# Altium schematic sheet Printing.SchDoc (part 2 of 2)
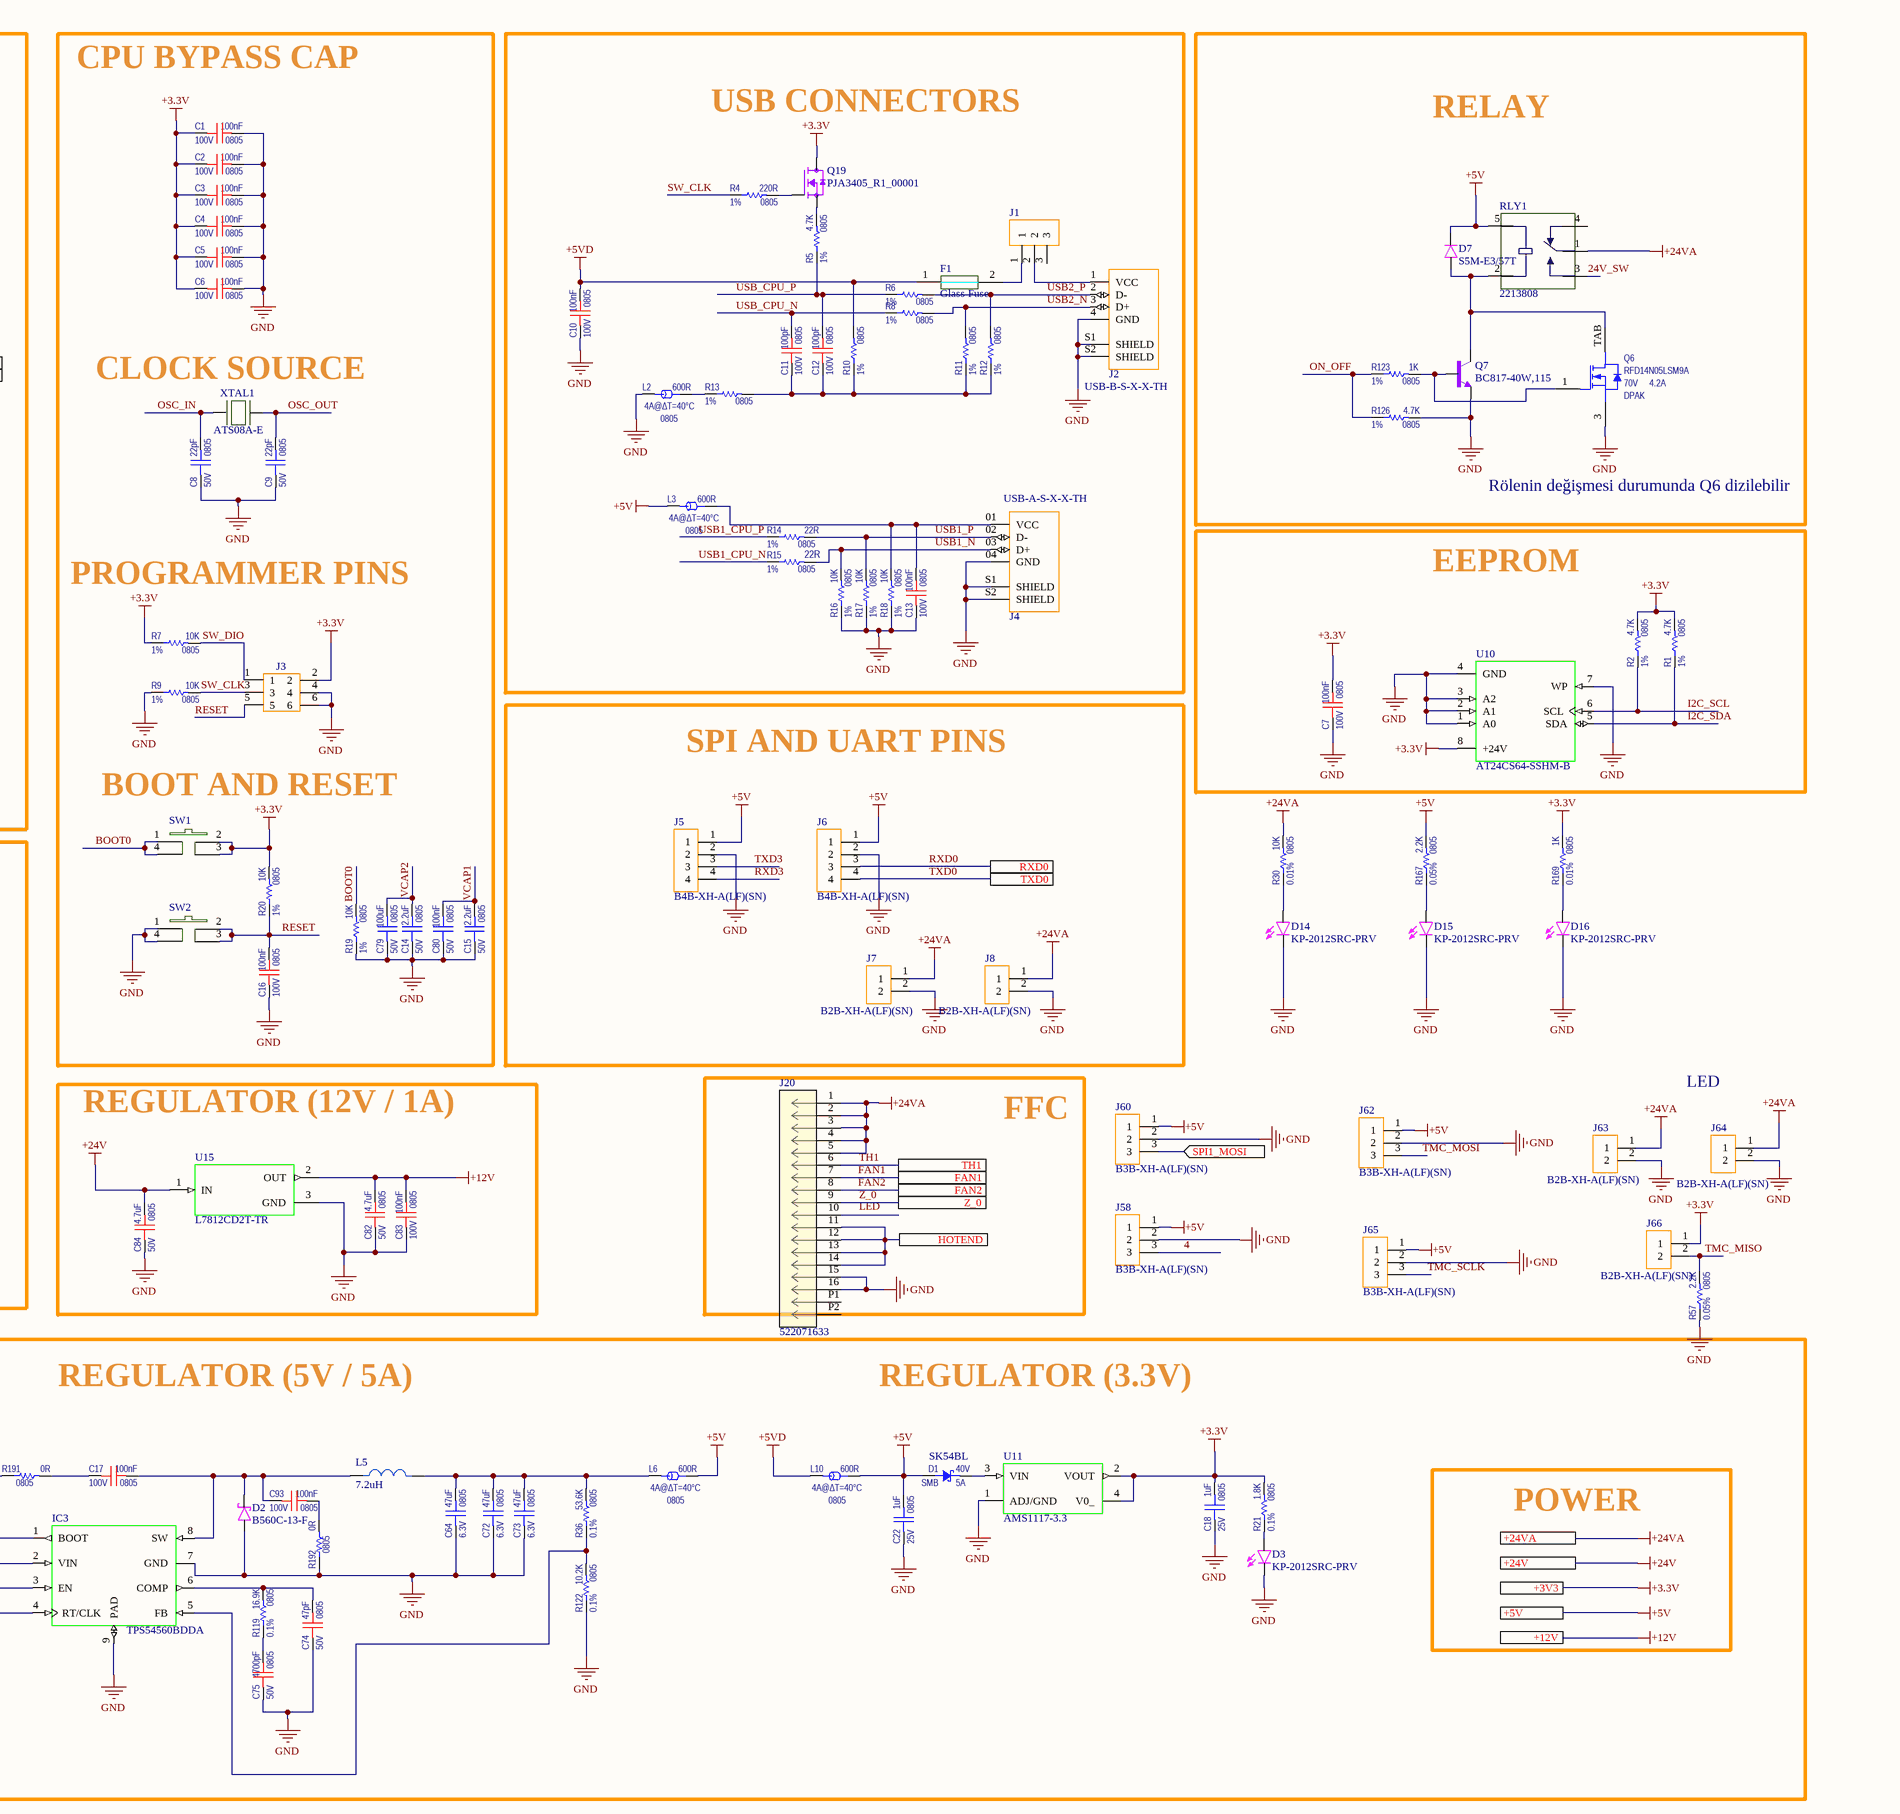
[diagram p2: Printing.SchDoc, right]

## Library data of the parts
C1-C7 C10-C13 C16 C17 C19 C27 C37 C70 C71 C74 C75 C77 C82-C85 C93 = CER_100nF_#4: CAP_CER_100nF_100V_X7R_10%_0805; Manufacturer#1: Kemet; Manufacturer#1 PN: C0805C104K1RECAUTO; Manufacturer#2 PN: ESD51C104K4T2A-24; Similar Part: C0805C104J1RECAUTO7210; C0805X104J1RECAUTO; Added by: İlhanT; FireANTs Code: C00062; Grade Level: Automotive; Lead Status: Pb-Free; Location: 3B16; Max Reflow Duration: 30; Max Reflow Temp: 260; Placement Area: 10.45; Power Rating: X; Temp# Operating: -55°C/+125°C; Tolerance: 10%; Identifier: CER_100nF_#4; Checked by: İlkerU; ComponentLink1Description: Resource Folder; ComponentLink1URL: C:\FireANTs_Repo\HW_Lib\trunk\ComponentLibrary\Resources\Capacitors\C00062; Cost: 0.27; Current: N/A; Failure in Time: N/A; Features: AEC-Q200; ESD withstanding; Height: 1.40; Manufacturer#2: AVX; MSL: 1; Mounting Type: SMD; Part Status: Active; Temp# Storage: N/A; Weight: 19mg
C8 C9 = CER_22pF_#2: CAP_CER_22pF_50V_X5R_5%_0805; Manufacturer#1: Kemet; Manufacturer#1 PN: C0805C220J5GAC7800; Added by: HicabiB; FireANTs Code: C00169; Grade Level: Automotive; Lead Status: Pb-Free; Location: 3E18; Max Reflow Duration: 30; Max Reflow Temp: 260; Placement Area: 10.45; Power Rating: X; Temp# Operating: -55°C/+125°C; Tolerance: 5%; Identifier: CER_22pF_#2; Checked by: ???; ComponentLink1Description: Resource Folder; ComponentLink1URL: C:\FireANTs_Repo\HW_Lib\trunk\ComponentLibrary\Resources\Capacitors\C00169; Cost: 0.10; Current: N/A; Failure in Time: N/A; Features: N/A; Height: 0.88; Manufacturer#2: N/A; Manufacturer#2 PN: N/A; MSL: 1; Mounting Type: SMD; Part Status: Active; Similar Part: N/A; Temp# Storage: N/A; Weight: N/A
C14 C15 C79 C80 = CER_2.2uF_#9: CAP_CER_2.2uF_50V_X5R_10%_0805; Manufacturer#1: Samsung; Manufacturer#1 PN: CL21A225KBFNNNE; Added by: HicabiB; FireANTs Code: C00170; Grade Level: Automotive; Lead Status: Pb-Free; Location: 3F18; Max Reflow Duration: 30; Max Reflow Temp: 260; Placement Area: 10.45; Power Rating: X; Temp# Operating: -55°C/+85°C; Tolerance: 10%; Identifier: CER_2.2uF_#9; Checked by: ???; ComponentLink1Description: Resource Folder; ComponentLink1URL: C:\FireANTs_Repo\HW_Lib\trunk\ComponentLibrary\Resources\Capacitors\C00170; Cost: 0.22; Current: N/A; Failure in Time: N/A; Features: N/A; Height: 1.35; Manufacturer#2: N/A; Manufacturer#2 PN: N/A; MSL: 1; Mounting Type: SMD; Part Status: Active; Similar Part: N/A; Temp# Storage: N/A; Weight: 16.4mg
C18 C22 = CER_1uF_#1: CAP_CER_1uF_25V_X7R_10%_0805; Manufacturer#1: Kemet; Manufacturer#1 PN: C0805C105K3RACAUTO; Manufacturer#2 PN: GCM21BR71E105KA56L; Similar Part: CGA4J3X7R1E105K125AB; Added by: SonerI; FireANTs Code: C00010; Grade Level: Automotive; Lead Status: Pb-Free; Location: 3B3; Max Reflow Duration: 30; Max Reflow Temp: 260; Placement Area: 10.45; Power Rating: X; Temp# Operating: -55°C/+125°C; Tolerance: 10%; Identifier: CER_1uF_#1; Checked by: İlkerU; ComponentLink1Description: Resource Folder; ComponentLink1URL: C:\FireANTs_Repo\HW_Lib\trunk\ComponentLibrary\Resources\Capacitors\C00010; Cost: 0.19; Current: N/A; Failure in Time: N/A; Features: AEC-Q200; Height: 1.40; Manufacturer#2: Murata; MSL: 1; Mounting Type: SMD; Part Status: Active; Temp# Storage: N/A; Weight: 19mg
C20 C21 = SC1V107M6L07KVR
C64 C72 C73 = CER_47uF_#2: CAP_CER_47uF_6.3V_X5R_20%_0805; Manufacturer#1: Murata; Manufacturer#1 PN: GRM21BR60J476ME15L; Manufacturer#2 PN: C0805C476M9PACTU; Similar Part: JMK212BBJ476MG-T; Added by: HasanA; FireANTs Code: C00140; Grade Level: Industrial; Lead Status: Pb-Free; Location: 3H10; Max Reflow Duration: 30; Max Reflow Temp: 260; Placement Area: 10.45; Power Rating: X; Temp# Operating: -55°C/+85°C; Tolerance: 20%; Identifier: CER_47uF_#2; Checked by: İlkerU; ComponentLink1Description: Resource Folder; ComponentLink1URL: C:\FireANTs_Repo\HW_Lib\trunk\ComponentLibrary\Resources\Capacitors\C00140; Cost: 0.48; Current: N/A; Failure in Time: N/A; Features: N/A; Height: 1.40; Manufacturer#2: Kemet; MSL: 1; Mounting Type: SMD; Part Status: Not For New Designs; Temp# Storage: N/A; Weight: 19mg
C94 = CER_1nF_#8: CAP_CER_1nF_50V_NP0_1%_0805; Manufacturer#1: Yageo; Manufacturer#1 PN: CC0805FRNPO9BN102; Manufacturer#2 PN: VJ0805A102FXACW1BC; Similar Part: 08055A102FAT2A; Added by: İlhanT; FireANTs Code: C00021; Grade Level: Industrial; Lead Status: Pb-Free; Location: 3A6; Max Reflow Duration: 30; Max Reflow Temp: 260; Placement Area: 10.45; Power Rating: X; Temp# Operating: -55°C/+125°C; Tolerance: 1%; Identifier: CER_1nF_#8; Checked by: İlkerU; ComponentLink1Description: Resource Folder; ComponentLink1URL: C:\FireANTs_Repo\HW_Lib\trunk\ComponentLibrary\Resources\Capacitors\C00021; Cost: 0.27; Current: N/A; Failure in Time: N/A; Features: N/A; Height: 0.70; Manufacturer#2: Vishay; MSL: 1; Mounting Type: SMD; Part Status: Active; Temp# Storage: N/A; Weight: 9.6mg
D1 D8 D17 = SCHO_60V_3A_#1: DIO_SCHO_SING_60V_3A_SMB; Manufacturer#1: Onsemi; Manufacturer#2 PN: MBRS360BT3G; Similar Part: STPS3H100UFY; Value: NRVBS360BT3G; Added by: SonerI; FireANTs Code: D00042; Failure in Time: 0.16@[60%CL; 55°C; 0.7eV]; Grade Level: Automotive; Lead Status: Pb-Free; Location: 4F11; Max Reflow Duration: 10; Max Reflow Temp: 260; Placement Area: 36.00; Temp# Operating: -65°C/+175°C; Tolerance: X; Identifier: SCHO_60V_3A_#1; Checked by: ErayC; ComponentLink1Description: Resource Folder; ComponentLink1URL: C:\FireANTs_Repo\HW_Lib\trunk\ComponentLibrary\Resources\Diodes\D00042; Cost: 0.84; Features: AEC-Q101; Fast recovery; Schottky Power Rectifier; Height: 2.47; Manufacturer#1 PN: NRVBS360BT3G; Manufacturer#2: Onsemi; MSL: 1; Mounting Type: SMD; Part Status: Active; Power Rating: N/A; Temp# Storage: -65°C/+175°C; Weight: 101.45mg
D2 = B560C-13-F: VR=60V IF=5A 300pF; Manufacturer: Diodes; Forward Current: 5A; Max Reverse Current: 500uA; Max Repetitive Reverse Voltage (Vrrm): 60V; Element Configuration: Single; Polarity: Standard; Forward Voltage: 700mV; Max Forward Surge Current (Ifsm): 100A; Supplier 1: Farnell; Manufacturer Part Number: B560C-13-F; RoHS: Yes; Category: Rectifier Diodes; Stock 1: 3160; Pricing 1: 5=0,58300, 10=0,49900, 100=0,37300, 500=0,29400 (EUR); Mount: Surface Mount; Case/Package: SMC; Number of Pins: 2; Weight: 0.007408oz; Contact Plating: Tin,Matte; Min Operating Temperature: -55°C; Max Operating Temperature: 125°C; Package Quantity: 3000; Packaging: Tape and Reel; Output Current: 5A; Series: -; Average Rectified Current: 5A; Peak Non-Repetitive Surge Current: 100A; Termination: SMD/SMT; Voltage Rating (DC): 60V; Current Rating: 5A; Capacitance: 300pF; Max Reverse Voltage (DC): 60V; Length: 7.11mm; Width: 6.22mm; Height: 2.5mm; Radiation Hardening: No; Lead Free: Lead Free; RoHS Compliant: Yes; Reach SVHC Compliant: Yes; ComponentLink1URL: https://datasheet.ciiva.com/27052/1538961-27052355.pdf?src-supplier=Jameco; ComponentLink1Description: https://datasheet.ciiva.com/27052/1538961-27052355.pdf?src-supplier=Jameco; ComponentLink2URL: https://datasheet.ciiva.com/1177/ds13012-1177532.pdf?src-supplier=Element14; ComponentLink2Description: https://datasheet.ciiva.com/1177/ds13012-1177532.pdf?src-supplier=Element14; ComponentLink3URL: https://datasheet.ciiva.com/16389/ds13012-16389735.pdf?src-supplier=Future+Electronics; ComponentLink3Description: https://datasheet.ciiva.com/16389/ds13012-16389735.pdf?src-supplier=Future+Electronics; ComponentLink4URL: https://datasheet.ciiva.com/15144/getdatasheetpartid-89786-15144652.pdf?src-supplier=Verical; ComponentLink4Description: https://datasheet.ciiva.com/15144/getdatasheetpartid-89786-15144652.pdf?src-supplier=Verical; ComponentLink5URL: https://datasheet.ciiva.com/914/ds13012-914986.pdf?src-supplier=Digi-Key; ComponentLink5Description: https://datasheet.ciiva.com/914/ds13012-914986.pdf?src-supplier=Digi-Key; ComponentLink6URL: https://datasheet.ciiva.com/914/ds13012-914987.pdf?src-supplier=Digi-Key; ComponentLink6Description: https://datasheet.ciiva.com/914/ds13012-914987.pdf?src-supplier=Digi-Key; ComponentLink7URL: https://datasheet.ciiva.com/914/ds13012-914985.pdf?src-supplier=Digi-Key; ComponentLink7Description: https://datasheet.ciiva.com/914/ds13012-914985.pdf?src-supplier=Digi-Key; Supplier Part Number 1: 1858602
D3 D6 D14-D16 = KP-2012SRC-PRV: KP-2012SRC-PRV Red LED, 640 nm 2012 (0805), Rectangle Lens SMD package; Manufacturer: Kingbright; Lens Color: Clear; Viewing Angle: 120°; Lens Style: Rectangular,Diffused,Colorless; Number of LEDs: 1; Wavelength: 640nm; Luminous Intensity: 100mcd; Forward Voltage: 1.85V; Forward Current: 20mA; Supplier 1: Farnell; Manufacturer Part Number: KP-2012SRC-PRV; RoHS: Yes; Category: LEDs; Pricing 1: 5=0,12900, 50=0,10200, 100=0,09830, 500=0,08370, 1000=0,07290 (EUR); Mount: Surface Mount; Case/Package: 2012; Number of Pins: 2; Color: Red; Min Operating Temperature: -40°C; Max Operating Temperature: 85°C; Packaging: Cut Tape; Dominant Wavelength: 640nm; Radiation Hardening: No; Reach SVHC Compliant: Yes; RoHS Compliant: Yes; ComponentLink1URL: https://datasheet.ciiva.com/14176/kp2012src-prv-eng-tds-14176962.pdf?src-supplier=Distrelec; ComponentLink1Description: https://datasheet.ciiva.com/14176/kp2012src-prv-eng-tds-14176962.pdf?src-supplier=Distrelec; ComponentLink2URL: https://datasheet.ciiva.com/11773/0900766b8032fa8d-11773524.pdf?src-supplier=RSComponents; ComponentLink2Description: https://datasheet.ciiva.com/11773/0900766b8032fa8d-11773524.pdf?src-supplier=RSComponents; ComponentLink3URL: https://datasheet.ciiva.com/14634/0900766b8032fa8d-14634746.pdf?src-supplier=Allied+Electronics; ComponentLink3Description: https://datasheet.ciiva.com/14634/0900766b8032fa8d-14634746.pdf?src-supplier=Allied+Electronics; ComponentLink4URL: https://datasheet.ciiva.com/29281/180105-da-01-en-led-0805-typ-kp-2012src-prv-29281248.pdf?src-supplier=Conrad; ComponentLink4Description: https://datasheet.ciiva.com/29281/180105-da-01-en-led-0805-typ-kp-2012src-prv-29281248.pdf?src-supplier=Conrad; Supplier Part Number 1: 1318244
D7 = S5M-E3/57T: STANDARD DIODE, 5A, 1KV, DO-214AB, FULL REEL; Diode Configuration:Single; Repetitive Reverse Voltage Vrrm Max:1kV; Forward Current If(AV):5A; Forward Voltage VF Max:1.15V; Forward Surge Current Ifsm Max:100A; No. of Pins:2 Pin ;RoHS Compliant: Yes; Manufacturer: Vishay Semiconductors; Max Surge Current: 100A; Forward Voltage: 1.15V; Max Reverse Current: 10uA; Reverse Recovery Time: 2.5us; Element Configuration: Single; Recovery Time: 2500ns; Capacitance: 40pF; Supplier 1: Farnell; Manufacturer Part Number: S5M-E3/57T; RoHS: Yes; Category: Rectifier Diodes; Stock 1: 21261; Pricing 1: 5=0,46000, 10=0,38000, 100=0,29400, 500=0,17900, 1000=0,15400, 5000=0,14900 (EUR); Mount: Surface Mount; Case/Package: SMC; Number of Pins: 2; Contact Plating: Tin,Matte; Min Operating Temperature: -55°C; Max Operating Temperature: 150°C; Package Quantity: 850; Packaging: Tape and Reel; Forward Current: 5A; Average Rectified Current: 5A; Max Repetitive Reverse Voltage (Vrrm): 1kV; Peak Non-Repetitive Surge Current: 100A; Max Forward Surge Current (Ifsm): 100A; Max Reverse Voltage (DC): 1kV; Series: -; Polarity: Standard; Voltage Rating (DC): 1kV; Current Rating: 5A; Output Current: 5A; Current: 5A; Voltage: 1kV; Reverse Voltage: 1kV; Length: 7.11mm; Width: 6.22mm; Height: 2.42mm; Radiation Hardening: No; RoHS Compliant: Yes; Lead Free: Lead Free; ComponentLink1URL: https://datasheet.ciiva.com/26295/1912895-26295382.pdf?src-supplier=Element14; ComponentLink1Description: https://datasheet.ciiva.com/26295/1912895-26295382.pdf?src-supplier=Element14; ComponentLink2URL: https://datasheet.ciiva.com/46435/1794161-46435942.pdf?src-supplier=Element14; ComponentLink2Description: https://datasheet.ciiva.com/46435/1794161-46435942.pdf?src-supplier=Element14; ComponentLink3URL: https://datasheet.ciiva.com/8287/s5a-8287111.pdf?src-supplier=Avnet; ComponentLink3Description: https://datasheet.ciiva.com/8287/s5a-8287111.pdf?src-supplier=Avnet; Supplier Part Number 1: 2395851
Fuse1 = 696310001002: Fuse Holder 20 A 250V 1 Circuit Cartridge Through Hole; MF: Wurth Elektronik; Package: None; Price: None; Value: *; SnapEDA_Link: https://www.snapeda.com/parts/696310001002/Wurth+Elektronik/view-part/?ref=snap; MP: 696310001002; Availability: In Stock; Check_prices: https://www.snapeda.com/parts/696310001002/Wurth+Elektronik/view-part/?ref=eda
IC2 = MCU-STM32F407VET6(LQFP100): ARMÂ® CortexÂ®-M4 STM32F4 Microcontroller IC 32-Bit 168MHz 512KB _512K x 8_ FLASH 100-LQFP _14x14_; MF: STMicroelectronics; SnapEDA_Link: https://www.snapeda.com/parts/STM32F407VET6/STMicroelectronics/view-part/45214/?ref=snap; MP: STM32F407VET6; Price: None; Package: LQFP-100 STMicroelectronics; Value: *; Availability: Unavailable
IC3 = TPS54560BDDA: 4.5-V to 60-V input, 5-A, step-down DC-DC converter with Eco-mode 8-SO PowerPAD -40 to 150; MF: Texas Instruments; Arrow_Electronics-Purchase-URL: https://snapeda.com/shop?store=Arrow+Electronics&id=4328218; Price: None; SnapEDA_Link: https://www.snapeda.com/parts/TPS54560BDDA/Texas%20Instruments/view-part/4328218/?ref=snap; Mouser-Purchase-URL: https://snapeda.com/shop?store=Mouser&id=4328218; DigiKey-Purchase-URL: https://snapeda.com/shop?store=DigiKey&id=4328218; Value: *; Package: HSOIC-8 Texas Instruments; Availability: Good; Texas_Instruments-Purchase-URL: https://snapeda.com/shop?store=Texas+Instruments&id=4328218; MP: TPS54560BDDA
J2 = USB-B-S-X-X-TH: USB-B (USB TYPE-B) USB 2.0 Receptacle Connector 4 Position Through Hole, Right Angle; Package: None; Price: None; Availability: Unavailable; MP: USB-B-S-X-X-TH; Value: *; Supplier 1: Farnell; Supplier Part Number 1: 3664925
J4 = USB-A-S-X-X-TH: USB-A (USB TYPE-A) USB 2.0 Receptacle Connector 4 Position Through Hole, Right Angle; MP: USB-A-S-S-W-TH; MF: Samtec; Package: None; Value: *; SnapEDA_Link: https://www.snapeda.com/parts/USB-A-S-S-W-TH/Samtec%20Inc./view-part/423470/?ref=snap; Digi-Key_Part_Number: SAM10373-ND; Toby_UK-Purchase-URL: https://snapeda.com/shop?store=Toby+UK&id=423470
J7 J8 J63 J64 J66 = B2B-XH-A(LF)(SN): Connector Header Through Hole 2 position 0.098 (2.50mm); MF: JST Sales; MP: B2B-XH-A(LF)(SN); Package: None; SnapEDA_Link: https://www.snapeda.com/parts/B2B-XH-A(LF)(SN)/JST+Sales+America+Inc./view-part/?ref=snap; Purchase-URL: https://pricing.snapeda.com/search/part/B2B-XH-A(LF)(SN)/?ref=eda; Check_prices: https://www.snapeda.com/parts/B2B-XH-A(LF)(SN)/JST+Sales+America+Inc./view-part/?ref=eda; Availability: In Stock; Value: *; Price: None
J20 = 522071633: No Description Available; Mfr_Name: Molex Connector Corporation; RefDes: RefDes; Type: Type
J47 = BH10B-XH-2(LF)(SN): Connector Header, XH Series, 10 Position, 2.5mm, 250V, Through Hole, Press Fit, Solder, Natural; Manufacturer: JST; Supplier 1: Digi-Key; Manufacturer Part Number: BH10B-XH-2(LF)(SN); RoHS: No; Category: Connectors; Stock 1: 53; Pricing 1: 1=0,77000, 10=0,65200, 100=0,58540, 500=0,47898, 1000=0,42576, 5000=0,37254, 10000=0,35392 (USD); ComponentLink1URL: http://www.jst-mfg.com/product/pdf/eng/eXH-H.pdf?src-supplier=Digi-Key; ComponentLink1Description: http://www.jst-mfg.com/product/pdf/eng/eXH-H.pdf?src-supplier=Digi-Key; Supplier Part Number 1: 455-BH10B-XH-2(LF)(SN)-ND
L1-L4 L6 L10 = FER_600R@100M_#2: IND_FER_600R@100M_2A_25%_0805; Manufacturer#1: Vishay; Manufacturer#1 PN: ILHB0805ER601V; Added by: HasanA; FireANTs Code: L00036; Grade Level: Industrial; Lead Status: Pb-Free; Location: 1R9; Max Reflow Duration: 10; Max Reflow Temp: 260; Placement Area: 10.45; Power Rating: X; Temp# Operating: -55°C/+125°C; Tolerance: ±25%; Identifier: FER_600R@100M_#2; Checked by: ErayC; ComponentLink1Description: Resource Folder; ComponentLink1URL: C:\FireANTs_Repo\HW_Lib\trunk\ComponentLibrary\Resources\Inductors\L00036; Cost: 0.11; Failure in Time: N/A; Features: N/A; Height: 1.10; Manufacturer#2: N/A; Manufacturer#2 PN: N/A; MSL: 1; Mounting Type: SMD; Part Status: Active; Similar Part: N/A; Temp# Storage: -55°C/+125°C; Voltage: X; Weight: 16mg
L5 = 7447798720: Fixed Ind 7.2UH 7.9A 12.8 Mohm; Manufacturer: Wurth Electronics; Core Material: Metal,Composite,Ferrite; Saturation Current: 6A; Tolerance: 30%; Shielding: Shielded; Self Resonant Frequency: 31MHz; DC Resistance (DCR): 12.8mR; Test Frequency: 100kHz; Max DC Current: 6.5A; Supplier 1: Newark; Manufacturer Part Number: 7447798720; RoHS: Yes; Category: Fixed Inductors; Mount: Surface Mount; Case/Package: Nonstandard; Min Operating Temperature: -40°C; Max Operating Temperature: 150°C; Package Quantity: 1; Current Rating: 7.9A; Packaging: Tape and Reel; Inductance Tolerance: 30%; Resistor Type: Wirewound; Inductance: 7.2uH; Termination: SMD/SMT; RMS Current (Irms): 7.9A; Series: WE-PDF; Length: 0.402inch; Width: 10.2mm; Height: 6.4mm; Height - Seated (Max): 0.252inch; RoHS Compliant: Yes; ComponentLink1URL: https://datasheet.ciiva.com/7892/1736564-7892967.pdf?src-supplier=Element14; ComponentLink1Description: https://datasheet.ciiva.com/7892/1736564-7892967.pdf?src-supplier=Element14; ComponentLink2URL: https://datasheet.ciiva.com/6171/530544-6171082.pdf?src-supplier=Farnell; ComponentLink2Description: https://datasheet.ciiva.com/6171/530544-6171082.pdf?src-supplier=Farnell; ComponentLink3URL: https://datasheet.ciiva.com/4954/7447798720-38957-4954724.pdf?src-supplier=Mouser; ComponentLink3Description: https://datasheet.ciiva.com/4954/7447798720-38957-4954724.pdf?src-supplier=Mouser; ComponentLink4URL: https://datasheet.ciiva.com/1060/7447798720-1060960.pdf?src-supplier=Digi-Key; ComponentLink4Description: https://datasheet.ciiva.com/1060/7447798720-1060960.pdf?src-supplier=Digi-Key; ComponentLink5URL: https://datasheet.ciiva.com/1060/7447798720-1060961.pdf?src-supplier=Digi-Key; ComponentLink5Description: https://datasheet.ciiva.com/1060/7447798720-1060961.pdf?src-supplier=Digi-Key; ComponentLink6URL: https://datasheet.ciiva.com/1060/7447798720-1060962.pdf?src-supplier=Digi-Key; ComponentLink6Description: https://datasheet.ciiva.com/1060/7447798720-1060962.pdf?src-supplier=Digi-Key; Supplier Part Number 1: 78R5736
Q6 = NMOS_100V-50A_#1: TRA_NMOS_SING_100V_50A_TH2V_DPAK; Manufacturer#1: Vishay; Manufacturer#1 PN: SQD50N10-8M9L; Similar Part: SQM70060EL_GE3; SQM100N10-10_GE3; Added by: İlhanT; FireANTs Code: Q00028; Failure in Time: 1.84@[60%CL; 55°C; 0.7eV]; Grade Level: Automotive; Lead Status: Pb-Free; Location: 4D7; Max Reflow Duration: 10; Max Reflow Temp: 260; Placement Area: 97.50; Power Rating: X; Temp# Operating: -55°C/+175°C; Identifier: NMOS_100V-50A_#1; Checked by: YasinY; ComponentLink1Description: Resource Folder; ComponentLink1URL: C:\BNA_Repo\HW_Lib\trunk\ComponentLibrary\Resources\Transistors\Q00028; Cost: 1.54; Features: AEC-Q101;  Single nMOS; Rdson=11.2mR@Vgs=4.5V@25°C; Qgate(tot)=70nC; Vgsmax=±20V; Height: 2.38; Manufacturer#2: N/A; Manufacturer#2 PN: N/A; MSL: 1; Mounting Type: SMD; Part Status: Active; Temp# Storage: -55°C/+175°C; Tolerance: X; Weight: 370mg
Q7 = BC817-40W,115: NPN Ic=500mA Vceo=45V hfe=250~600 P=250mW; Manufacturer: Nexperia; Supplier 1: Farnell; Manufacturer Part Number: BC817-40W,115; RoHS: Yes; Category: BJTs; Stock 1: 58090; Pricing 1: 5=0,16300, 50=0,12900, 100=0,09400, 500=0,04600 (EUR); RoHS Compliant: Yes; ComponentLink1URL: http://www.farnell.com/datasheets/2242064.pdf?src-supplier=Farnell; ComponentLink1Description: http://www.farnell.com/datasheets/2242064.pdf?src-supplier=Farnell; ComponentLink2URL: https://assets.nexperia.com/documents/data-sheet/BC817W_SER.pdf?src-supplier=Digi-Key; ComponentLink2Description: https://assets.nexperia.com/documents/data-sheet/BC817W_SER.pdf?src-supplier=Digi-Key; ComponentLink3URL: http://www.farnell.com/datasheets/2242064.pdf?src-supplier=Newark; ComponentLink3Description: http://www.farnell.com/datasheets/2242064.pdf?src-supplier=Newark; Supplier Part Number 1: 2319233
Q19 = PJA3405_R1_00001: Power Field-Effect Transistor, 3.6A I(D), 30V, 0.073ohm, 1-Element, P-Channel, Silicon, Metal-oxide Semiconductor FET; Manufacturer: Pan Jit; Supplier 1: Digi-Key; Manufacturer Part Number: PJA3405_R1_00001; RoHS: Yes; Stock 1: 17264; Pricing 1: 1=0,44000, 10=0,33400, 100=0,20830, 500=0,14250, 1000=0,10962 (USD); Supplier Part Number 1: 3757-PJA3405_R1_00001CT-ND
R1 R2 R5 R126 R186 = STD_4.7K_#3: RES_STD_4.7K_0.125W_1%_100ppm_0805; Manufacturer#1: Yageo; Manufacturer#1 PN: AC0805FR-074K7L; Manufacturer#2 PN: ERJ-6ENF4701V; Added by: SonerI; FireANTs Code: R00230; Current: X; Grade Level: Automotive; Lead Status: Pb-Free; Location: TBD; Max Reflow Duration: 10; Max Reflow Temp: 260; Placement Area: 10.45; Power Rating: 125mW; Temp# Operating: -55°C/+155°C; Voltage: 150V; Identifier: STD_4.7K_#3; Checked by: YasinY; ComponentLink1Description: Resource Folder; ComponentLink1URL: C:\FireANTs_Repo\HW_Lib\trunk\ComponentLibrary\Resources\Resistors\R00230; Cost: 0.10; Failure in Time: N/A; Features: AEC-Q200; Height: 0.60; Manufacturer#2: Panasonic; MSL: 1; Mounting Type: SMD; Part Status: Active; Similar Part: N/A; Temp# Storage: N/A; Weight: 5.5mg
R3 = STD_100K_#3: RES_STD_100K_0.125W_1%_100ppm_0805; Manufacturer#1: Yageo; Manufacturer#1 PN: AC0805FR-07100KL; Manufacturer#2 PN: ERJ-6ENF1003V; Similar Part: ERJ-PB6D1003V; RT0805DRE07100KL; Added by: SonerI; FireANTs Code: R00189; Current: X; Grade Level: Automotive; Lead Status: Pb-Free; Location: 2E23; Max Reflow Duration: 10; Max Reflow Temp: 260; Placement Area: 10.45; Power Rating: 125mW; Temp# Operating: -55°C/+155°C; Voltage: 150V; Identifier: STD_100K_#3; Checked by: YasinY; ComponentLink1Description: Resource Folder; ComponentLink1URL: C:\FireANTs_Repo\HW_Lib\trunk\ComponentLibrary\Resources\Resistors\R00189; Cost: 0.10; Failure in Time: N/A; Features: AEC-Q200; Height: 0.70; Manufacturer#2: Panasonic; MSL: 1; Mounting Type: SMD; Part Status: Active; Temp# Storage: N/A; Weight: 5.5mg
R4 = STD_220R_#2: RES_STD_220R_0.125W_1%_100ppm_0805; Manufacturer#1: Vishay; Manufacturer#1 PN: CRCW0805220RFKEB; Added by: HicabiB; FireANTs Code: R00378; Current: X; Grade Level: Automotive; Lead Status: Pb-Free; Location: 2O20; Max Reflow Duration: 10; Max Reflow Temp: 260; Placement Area: 10.45; Power Rating: 125mW; Temp# Operating: -55°C/+155°C; Voltage: 150V; Identifier: STD_220R_#2; Checked by: ???; ComponentLink1Description: Resource Folder; ComponentLink1URL: C:\FireANTs_Repo\HW_Lib\trunk\ComponentLibrary\Resources\Resistors\R00378; Cost: 0.1; Failure in Time: N/A; Features: AEC-Q200; Height: 0.50; Manufacturer#2: N/A; Manufacturer#2 PN: N/A; MSL: 1; Mounting Type: SMD; Part Status: Active; Similar Part: N/A; Temp# Storage: N/A; Weight: 5.5mg
R6 R8 R10-R15 R123 = STD_4.7K_#3: RES_STD_4.7K_0.125W_1%_100ppm_0805; Manufacturer#1: Yageo; Manufacturer#1 PN: AC0805FR-074K7L; Manufacturer#2 PN: ERJ-6ENF4701V; Value: 4.7K; Added by: SonerI; FireANTs Code: R00230; Current: X; Grade Level: Automotive; Lead Status: Pb-Free; Location: TBD; Max Reflow Duration: 10; Max Reflow Temp: 260; Placement Area: 10.45; Power Rating: 125mW; Temp# Operating: -55°C/+155°C; Voltage: 150V; Identifier: STD_4.7K_#3; Checked by: YasinY; ComponentLink1Description: Resource Folder; ComponentLink1URL: C:\FireANTs_Repo\HW_Lib\trunk\ComponentLibrary\Resources\Resistors\R00230; Cost: 0.10; Failure in Time: N/A; Features: AEC-Q200; Height: 0.60; Manufacturer#2: Panasonic; MSL: 1; Mounting Type: SMD; Part Status: Active; Similar Part: N/A; Temp# Storage: N/A; Weight: 5.5mg
R7 R9 R16-R20 R113-R117 = STD_10K_#3: RES_STD_10K_0.125W_1%_100ppm_0805; Manufacturer#1: Yageo; Manufacturer#1 PN: AC0805FR-0710KL; Manufacturer#2 PN: ERJ-6ENF1002V; Added by: SonerI; FireANTs Code: R00121; Current: X; Grade Level: Automotive; Lead Status: Pb-Free; Location: 2E6; Max Reflow Duration: 10; Max Reflow Temp: 260; Placement Area: 10.45; Power Rating: 125mW; Temp# Operating: -55°C/+155°C; Voltage: 150V; Identifier: STD_10K_#3; Checked by: YasinY; ComponentLink1Description: Resource Folder; ComponentLink1URL: C:\FireANTs_Repo\HW_Lib\trunk\ComponentLibrary\Resources\Resistors\R00121; Cost: 0.10; Failure in Time: N/A; Features: AEC-Q200; Height: 0.70; Manufacturer#2: Panasonic; MSL: 1; Mounting Type: SMD; Part Status: Active; Similar Part: N/A; Temp# Storage: N/A; Weight: 5.5mg
R21 R34 R36 R118-R122 = STD_442K_#1: RES_STD_442K_0.125W_0.1%_25ppm_0805; Manufacturer#1: Panasonic; Manufacturer#1 PN: ERA-6AEB4423V; Manufacturer#2 PN: RG2012P-4423-B-T5; Similar Part: RN73C2A442KBTDF; Added by: İlhanT; FireANTs Code: R00098; Current: X; Grade Level: Automotive; Lead Status: Pb-Free; Location: 2B25; Max Reflow Duration: 10; Max Reflow Temp: 260; Placement Area: 10.45; Power Rating: 125mW; Temp# Operating: -55°C/+155°C; Voltage: 100V; Identifier: STD_442K_#1; Checked by: YasinY; ComponentLink1Description: Resource Folder; ComponentLink1URL: C:\FireANTs_Repo\HW_Lib\trunk\ComponentLibrary\Resources\Resistors\R00098; Cost: 0.31; Failure in Time: N/A; Features: AEC-Q200; Height: 0.70; Manufacturer#2: Susumu; MSL: 1; Mounting Type: SMD; Part Status: Active; Temp# Storage: N/A; Weight: 5.5mg
R29 R174 R175 = STD_JUMPER_#3: RES_STD_0R_0.125W_0805; Manufacturer#1: Yageo; Manufacturer#1 PN: AC0805JR-070RL; Manufacturer#2 PN: ERJ-6GEY0R00V; Value: 0R; Added by: İlhanT; FireANTs Code: R00008; Current: X; Grade Level: Automotive; Lead Status: Pb-Free; Location: 2D2; Max Reflow Duration: 10; Max Reflow Temp: 260; Placement Area: 10.45; Power Rating: 125mW; Temp# Operating: -55°C/+155°C; Tolerance: 5%; Voltage: 150V; Identifier: STD_JUMPER_#3; Checked by: YasinY; ComponentLink1Description: Resource Folder; ComponentLink1URL: C:\FireANTs_Repo\HW_Lib\trunk\ComponentLibrary\Resources\Resistors\R00008; Cost: 0.10; Failure in Time: N/A; Features: AEC-Q200; Height: 0.70; Manufacturer#2: Panasonic; MSL: 1; Mounting Type: SMD; Part Status: Active; Similar Part: N/A; Temp# Storage: N/A; Weight: 5.5mg
R30 = STD_10K_#4: RES_STD_10K_0.125W_0.01%_5ppm_0805; Manufacturer#1: Stackpole; Manufacturer#1 PN: RNCF0805TKY10K0; Manufacturer#2 PN: RNCF0805TKW10K0; Added by: HasanA; FireANTs Code: R00073; Current: X; Grade Level: Automotive; Lead Status: Pb-Free; Location: 2A19; Max Reflow Duration: 10; Max Reflow Temp: 260; Placement Area: 10.45; Power Rating: 125mW; Temp# Operating: -55°C/+155°C; Voltage: 150V; Identifier: STD_10K_#4; Checked by: YasinY; ComponentLink1Description: Resource Folder; ComponentLink1URL: C:\FireANTs_Repo\HW_Lib\trunk\ComponentLibrary\Resources\Resistors\R00073; Cost: 2.15; Failure in Time: N/A; Features: AEC-Q200; Height: 0.70; Manufacturer#2: Stackpole; MSL: 1; Mounting Type: SMD; Part Status: Active; Similar Part: N/A; Temp# Storage: N/A; Weight: 5.5mg
R57 R167 = STD_2.2K_#4: RES_STD_2.2K_0.125W_0.05%_10ppm_0805; Manufacturer#1: Panasonic; Manufacturer#1 PN: ERA-6ARW222V; Manufacturer#2 PN: RG2012N-222-W-T1; Added by: İlhanT; FireANTs Code: R00069; Current: X; Grade Level: Automotive; Lead Status: Pb-Free; Location: 2A18; Max Reflow Duration: 10; Max Reflow Temp: 260; Placement Area: 10.45; Power Rating: 125mW; Temp# Operating: -55°C/+155°C; Voltage: 100V; Identifier: STD_2.2K_#4; Checked by: YasinY; ComponentLink1Description: Resource Folder; ComponentLink1URL: C:\FireANTs_Repo\HW_Lib\trunk\ComponentLibrary\Resources\Resistors\R00069; Cost: 0.78; Failure in Time: N/A; Features: AEC-Q200; Height: 0.70; Manufacturer#2: Susumu; MSL: 1; Mounting Type: SMD; Part Status: Active; Similar Part: N/A; Temp# Storage: N/A; Weight: 5.5mg
R169 = STD_1K_#4: RES_STD_1K_0.125W_0.01%_5ppm_0805; Manufacturer#1: Stackpole; Manufacturer#1 PN: RNCF0805TKY1K00; Manufacturer#2 PN: PLT0805Z1001LBTS; Similar Part: PLTU0805U1001LST5; Added by: HasanA; FireANTs Code: R00068; Current: X; Grade Level: Automotive; Lead Status: Pb-Free; Location: 2D17; Max Reflow Duration: 10; Max Reflow Temp: 260; Placement Area: 10.45; Power Rating: 125mW; Temp# Operating: -55°C/+155°C; Voltage: 150V; Identifier: STD_1K_#4; Checked by: YasinY; ComponentLink1Description: Resource Folder; ComponentLink1URL: C:\FireANTs_Repo\HW_Lib\trunk\ComponentLibrary\Resources\Resistors\R00068; Cost: 2.15; Failure in Time: N/A; Features: AEC-Q200; Height: 0.70; Manufacturer#2: Vishay; MSL: 1; Mounting Type: SMD; Part Status: Active; Temp# Storage: N/A; Weight: 5.5mg
R191 R192 = STD_0R_#3: RES_STD_0R_0.125W_0805; Manufacturer#1: Yageo; Manufacturer#1 PN: AC0805JR-070RL; Manufacturer#2 PN: ERJ-6GEY0R00V; Added by: İlhanT; FireANTs Code: R00008; Current: X; Grade Level: Automotive; Lead Status: Pb-Free; Location: 2D2; Max Reflow Duration: 10; Max Reflow Temp: 260; Placement Area: 10.45; Power Rating: 125mW; Temp# Operating: -55°C/+155°C; Tolerance: 5%; Voltage: 150V; Identifier: STD_0R_#3; Checked by: YasinY; ComponentLink1Description: Resource Folder; ComponentLink1URL: C:\FireANTs_Repo\HW_Lib\trunk\ComponentLibrary\Resources\Resistors\R00008; Cost: 0.10; Failure in Time: N/A; Features: AEC-Q200; Height: 0.70; Manufacturer#2: Panasonic; MSL: 1; Mounting Type: SMD; Part Status: Active; Similar Part: N/A; Temp# Storage: N/A; Weight: 5.5mg
RLY1 = G5RL-1A-E-HR-DC24: Electromechanical Relay SPST-NO 16A 24VDC 1.44KOhm Through Hole; Manufacturer: Omron; Throw Configuration: SPST; Coil Current: 16.7mA; Coil Resistance: 1.44kR; Operate Time: 15ms; Coil Voltage (DC): 24V; Coil Type: Non-Latching; Max Voltage Rating (AC): 250V; Relay Type: General Purpose; Power Consumption: 400mW; Supplier 1: Farnell; Manufacturer Part Number: G5RL-1A-E-HR-DC24; RoHS: Yes; Category: Power Relays; Stock 1: 99; Pricing 1: 1=4,95, 10=4,18, 25=3,71, 50=3,53, 100=3,34 (EUR); Mount: Through Hole; Case/Package: DIP; Number of Pins: 6; Contact Material: Silver,Cadmium; Weight: 10g; Min Operating Temperature: -40°C; Max Operating Temperature: 85°C; Contact Current Rating: 16A; Termination: PC Pin; Max Voltage Rating (DC): 24V; Max Current Rating: 16A; Length: 28.8mm; Reach SVHC Compliant: Unknown; Lead Free: Lead Free; ComponentLink1URL: https://datasheet.ciiva.com/30265/65en-g5rl-30265020.pdf?src-supplier=Onlinecomponents.com; ComponentLink1Description: https://datasheet.ciiva.com/30265/65en-g5rl-30265020.pdf?src-supplier=Onlinecomponents.com; ComponentLink2URL: https://datasheet.ciiva.com/15732/g5rl-0609-15732111.pdf?src-supplier=Onlinecomponents.com; ComponentLink2Description: https://datasheet.ciiva.com/15732/g5rl-0609-15732111.pdf?src-supplier=Onlinecomponents.com; ComponentLink3URL: https://datasheet.ciiva.com/8000/697034-8000459.pdf?src-supplier=Element14; ComponentLink3Description: https://datasheet.ciiva.com/8000/697034-8000459.pdf?src-supplier=Element14
U10 = AT24CS64-SSHM-B: IC EEPROM 64K I2C 1MHZ 8SOIC; Package: None; Price: None; Value: *; MP: AT24CS64-SSHM-B; Availability: Unavailable
U11 = AMS1117-3.3: Sot223/Pkg 1-Amp 3.3-Volt Low Drop Out Voltage Regulatator; MF: Advanced Monolithic Systems; Price: None; Package: None; Value: *; MP: AMS1117-3.3; Availability: Unavailable; SnapEDA_Link: https://www.snapeda.com/parts/AMS1117-3.3/Advanced%20Monolithic%20Systems/view-part/53450/?ref=snap
U15 = L7812CD2T-TR: Linear Voltage Regulator IC Positive Fixed 1 Output 12V 1.5A D2PAK; Manufacturer: STMicroelectronics; Number of Outputs: 1; Max Input Voltage: 35V; Quiescent Current: 8mA; Min Input Voltage: 14V; Dropout Voltage: 2V; Power Supply Rejection Ratio (PSRR): 55dB; Supplier 1: Farnell; Manufacturer Part Number: L7812CD2T-TR; RoHS: Yes; Category: Voltage Regulators - Linear; Stock 1: 1396; Pricing 1: 1=1,17000, 10=0,99100, 100=0,76100, 500=0,67300 (EUR); Mount: Surface Mount; Case/Package: TO-263; Number of Pins: 3; Weight: 0.01lb; Contact Plating: Tin,Matte; Min Operating Temperature: 0°C; Max Operating Temperature: 125°C; Max Output Current: 1.5A; Output Voltage: 12V; Polarity: Positive; Output Type: Fixed; Output Current: 1.5A; Packaging: Tape and Reel; Package Quantity: 1; Nominal Output Voltage: 12V; Number of Regulators: 1; Min Output Voltage: 12V; Max Output Voltage: 12V; Series: -; Length: 10.4mm; Width: 9.35mm; Height: 4.6mm; Radiation Hardening: No; Reach SVHC Compliant: Yes; Lead Free: Lead Free; RoHS Compliant: Yes; ComponentLink1URL: https://datasheet.ciiva.com/34303/2027434-34303936.pdf?src-supplier=Jameco; ComponentLink1Description: https://datasheet.ciiva.com/34303/2027434-34303936.pdf?src-supplier=Jameco; ComponentLink2URL: https://datasheet.ciiva.com/5697/1696820-5697199.pdf?src-supplier=Farnell; ComponentLink2Description: https://datasheet.ciiva.com/5697/1696820-5697199.pdf?src-supplier=Farnell; ComponentLink3URL: https://datasheet.ciiva.com/1511/1805459-1511925.pdf?src-supplier=Element14; ComponentLink3Description: https://datasheet.ciiva.com/1511/1805459-1511925.pdf?src-supplier=Element14; ComponentLink4URL: https://datasheet.ciiva.com/7992/1805459-7992588.pdf?src-supplier=Element14; ComponentLink4Description: https://datasheet.ciiva.com/7992/1805459-7992588.pdf?src-supplier=Element14; ComponentLink5URL: https://datasheet.ciiva.com/2042/cd00000444-2042893.pdf?src-supplier=Digi-Key; ComponentLink5Description: https://datasheet.ciiva.com/2042/cd00000444-2042893.pdf?src-supplier=Digi-Key; ComponentLink6URL: https://datasheet.ciiva.com/2042/cd00000444-2042892.pdf?src-supplier=Digi-Key; ComponentLink6Description: https://datasheet.ciiva.com/2042/cd00000444-2042892.pdf?src-supplier=Digi-Key; ComponentLink7URL: https://datasheet.ciiva.com/2042/cd00000444-2042894.pdf?src-supplier=Digi-Key; ComponentLink7Description: https://datasheet.ciiva.com/2042/cd00000444-2042894.pdf?src-supplier=Digi-Key
XTAL1 = ATS08A-E: 8MHz Â±30ppm Crystal 20pF 60 Ohms HC-49/US; MF: CTS-Frequency Controls; Price: None; Availability: Good; Package: HC-49/US CTS-Frequency Controls; Purchase-URL: https://pricing.snapeda.com/search/part/ATS08A-E/?ref=eda; SnapEDA_Link: https://www.snapeda.com/parts/ATS08A-E/CTS-Frequency%20Controls/view-part/2457201/?ref=snap; Value: *; MP: ATS08A-E; Check_prices: https://www.snapeda.com/parts/ATS08A-E/CTS-Frequency%20Controls/view-part/2457201/?ref=eda
J5 J6 = B4B-XH-A(LF)(SN): Price: None; MP: B4B-XH-A(LF)(SN); Value: *; Availability: Unavailable; Package: None
J58 J60 J62 J65 = B3B-XH-A(LF)(SN): Value: *; MP: B3B-XH-A(LF)(SN); Availability: Unavailable; Package: None; Price: None